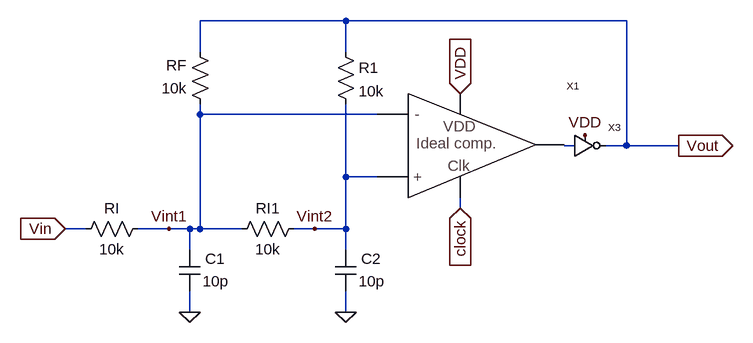
[diagram p0: schematic 1_bit_2nd_PNS_mod_MSD.asc]
1_bit_2nd_PNS_mod_MSD.asc, the LTspice schematic file:
Version 4
SHEET 1 900 680
WIRE 96 -96 -128 -96
WIRE 528 -96 96 -96
WIRE -128 -48 -128 -96
WIRE 96 -48 96 -96
WIRE -128 48 -128 32
WIRE 144 48 -128 48
WIRE 448 96 432 96
WIRE 528 96 528 -96
WIRE 528 96 496 96
WIRE 608 96 528 96
WIRE 96 144 96 32
WIRE 144 144 96 144
WIRE 272 192 272 176
WIRE -304 224 -336 224
WIRE -176 224 -224 224
WIRE -144 224 -176 224
WIRE -128 224 -128 48
WIRE -128 224 -144 224
WIRE -64 224 -128 224
WIRE 48 224 16 224
WIRE 96 224 96 144
WIRE 96 224 48 224
WIRE -144 256 -144 224
WIRE 96 256 96 224
WIRE -144 352 -144 320
WIRE 96 352 96 320
FLAG 272 16 VDD
IOPIN 272 16 In
FLAG 272 192 clock
IOPIN 272 192 In
FLAG 608 96 Vout
IOPIN 608 96 Out
FLAG -144 352 0
FLAG -336 224 Vin
IOPIN -336 224 In
FLAG -176 224 Vint1
FLAG 96 352 0
FLAG 48 224 Vint2
FLAG 464 80 VDD
SYMBOL Ideal_clocked_comparator 192 96 R0
SYMATTR InstName X1
SYMBOL cap -160 256 R0
WINDOW 0 40 14 Left 0
WINDOW 3 36 49 Left 0
SYMATTR InstName C1
SYMATTR Value 10p
SYMBOL res -208 208 R90
WINDOW 0 0 56 VBottom 0
WINDOW 3 32 56 VTop 0
SYMATTR InstName RI
SYMATTR Value 10k
SYMBOL res -112 48 R180
WINDOW 0 36 76 Left 0
WINDOW 3 36 40 Left 0
SYMATTR InstName RF
SYMATTR Value 10k
SYMBOL res 80 -64 R0
SYMATTR InstName R1
SYMATTR Value 10k
SYMBOL res 32 208 R90
WINDOW 0 0 56 VBottom 0
WINDOW 3 32 56 VTop 0
SYMATTR InstName RI1
SYMATTR Value 10k
SYMBOL cap 80 256 R0
WINDOW 0 40 14 Left 0
WINDOW 3 36 49 Left 0
SYMATTR InstName C2
SYMATTR Value 10p
SYMBOL inverter 448 96 R0
SYMATTR InstName X3

The netlist it stands for:
* 1_bit_2nd_PNS_mod_MSD.asc
XX1 Vint1 Vint2 N001 VDD clock Ideal_clocked_comparator  ; pins Vinm Vinp Vout VDD Clock
C1 Vint1 0 10p
RI Vint1 Vin 10k
RF Vint1 Vout 10k
R1 Vout Vint2 10k
RI1 Vint2 Vint1 10k
C2 Vint2 0 10p
XX3 N001 Vout VDD inverter  ; pins In Out VDD
.backanno
.end